# EAGLE design scheme (EAGLE 6.5.0)
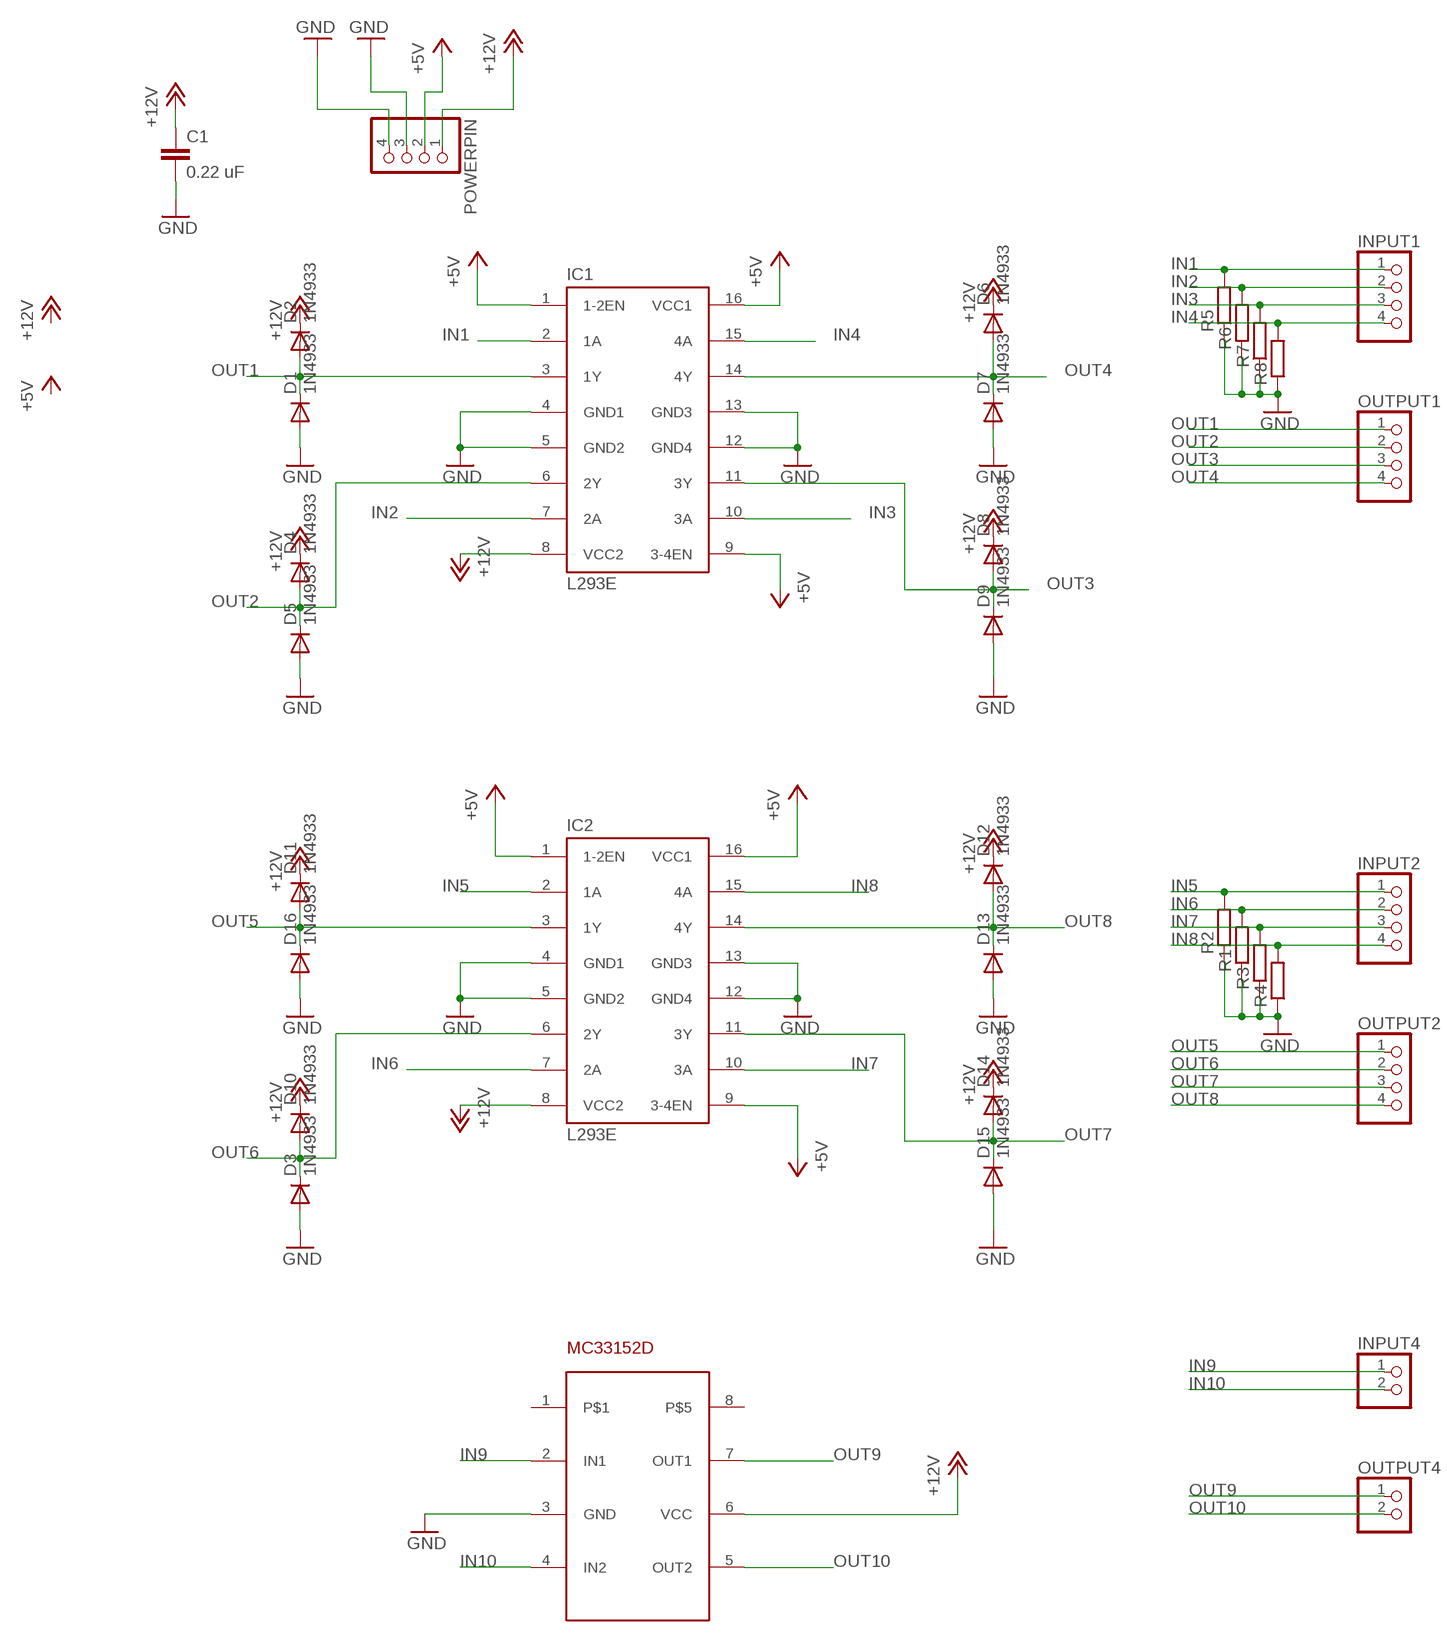
[diagram p0: schematic, sheet 1]

## Parts
C1  0.22 uF  C-EUC0805K  [C0805K]
D1  1N4933  [DO41-10]
D2  1N4933  [DO41-10]
D3  1N4933  [DO41-10]
D4  1N4933  [DO41-10]
D5  1N4933  [DO41-10]
D6  1N4933  [DO41-10]
D7  1N4933  [DO41-10]
D8  1N4933  [DO41-10]
D9  1N4933  [DO41-10]
D10  1N4933  [DO41-10]
D11  1N4933  [DO41-10]
D12  1N4933  [DO41-10]
D13  1N4933  [DO41-10]
D14  1N4933  [DO41-10]
D15  1N4933  [DO41-10]
D16  1N4933  [DO41-10]
IC1  L293E  [DIL16]
IC2  L293E  [DIL16]
INPUT1  PINHD-1X4  [1X04]
INPUT2  PINHD-1X4  [1X04]
INPUT4  PINHD-1X2  [1X02]
MC33152D  MC33152D  [SOIC8]
OUTPUT1  PINHD-1X4  [1X04]
OUTPUT2  PINHD-1X4  [1X04]
OUTPUT4  PINHD-1X2  [1X02]
POWERPIN  PINHD-1X4  [1X04]
R1  R-EU_R0805  [R0805]
R2  R-EU_R0805  [R0805]
R3  R-EU_R0805  [R0805]
R4  R-EU_R0805  [R0805]
R5  R-EU_R0805  [R0805]
R6  R-EU_R0805  [R0805]
R7  R-EU_R0805  [R0805]
R8  R-EU_R0805  [R0805]

## Nets
+5V: IC1.1(1-2EN) IC1.9(3-4EN) IC1.16(VCC1) IC2.1(1-2EN) IC2.9(3-4EN) IC2.16(VCC1) POWERPIN.2
+12V: C1.1 D2.C D4.C D6.C D8.C D10.C D11.C D12.C D14.C IC1.8(VCC2) IC2.8(VCC2) MC33152D.6(VCC) POWERPIN.1
GND: C1.2 D1.A D3.A D5.A D7.A D9.A D13.A D15.A D16.A IC1.4(GND1) IC1.5(GND2) IC1.12(GND4) IC1.13(GND3) IC2.4(GND1) IC2.5(GND2) IC2.12(GND4) IC2.13(GND3) MC33152D.3(GND) POWERPIN.3 POWERPIN.4 R1.1 R2.1 R3.1 R4.1 R5.1 R6.1 R7.1 R8.1
IN1: IC1.2(1A) INPUT1.1 R5.2
IN2: IC1.7(2A) INPUT1.2 R6.2
IN3: IC1.10(3A) INPUT1.3 R7.2
IN4: IC1.15(4A) INPUT1.4 R8.2
IN5: IC2.2(1A) INPUT2.1 R2.2
IN6: IC2.7(2A) INPUT2.2 R1.2
IN7: IC2.10(3A) INPUT2.3 R3.2
IN8: IC2.15(4A) INPUT2.4 R4.2
IN9: INPUT4.1 MC33152D.2(IN1)
IN10: INPUT4.2 MC33152D.4(IN2)
OUT1: D1.C D2.A IC1.3(1Y) OUTPUT1.1
OUT2: D4.A D5.C IC1.6(2Y) OUTPUT1.2
OUT3: D8.A D9.C IC1.11(3Y) OUTPUT1.3
OUT4: D6.A D7.C IC1.14(4Y) OUTPUT1.4
OUT5: D11.A D16.C IC2.3(1Y) OUTPUT2.1
OUT6: D3.C D10.A IC2.6(2Y) OUTPUT2.2
OUT7: D14.A D15.C IC2.11(3Y) OUTPUT2.3
OUT8: D12.A D13.C IC2.14(4Y) OUTPUT2.4
OUT9: MC33152D.7(OUT1) OUTPUT4.1
OUT10: MC33152D.5(OUT2) OUTPUT4.2
Unconnected: MC33152D.1 MC33152D.8

## Library data of the parts
C1 = resistor:C-EU: CAPACITOR, European symbol
D1-D16 = diode:1N4933: DIODE fast recovery rectifier, 1A
IC1 IC2 = texas:L293E: TI DEVICE; MF: Arrow Electronics; MPN: L293E; OC_FARNELL: 1467711; OC_NEWARK: 89K0732
INPUT1 INPUT2 OUTPUT1 OUTPUT2 POWERPIN = pinhead:PINHD-1X4: PIN HEADER
INPUT4 OUTPUT4 = pinhead:PINHD-1X2: PIN HEADER
MC33152D = mylib:MC33152D
R1-R8 = resistor:R-EU_: RESISTOR, European symbol

## Board
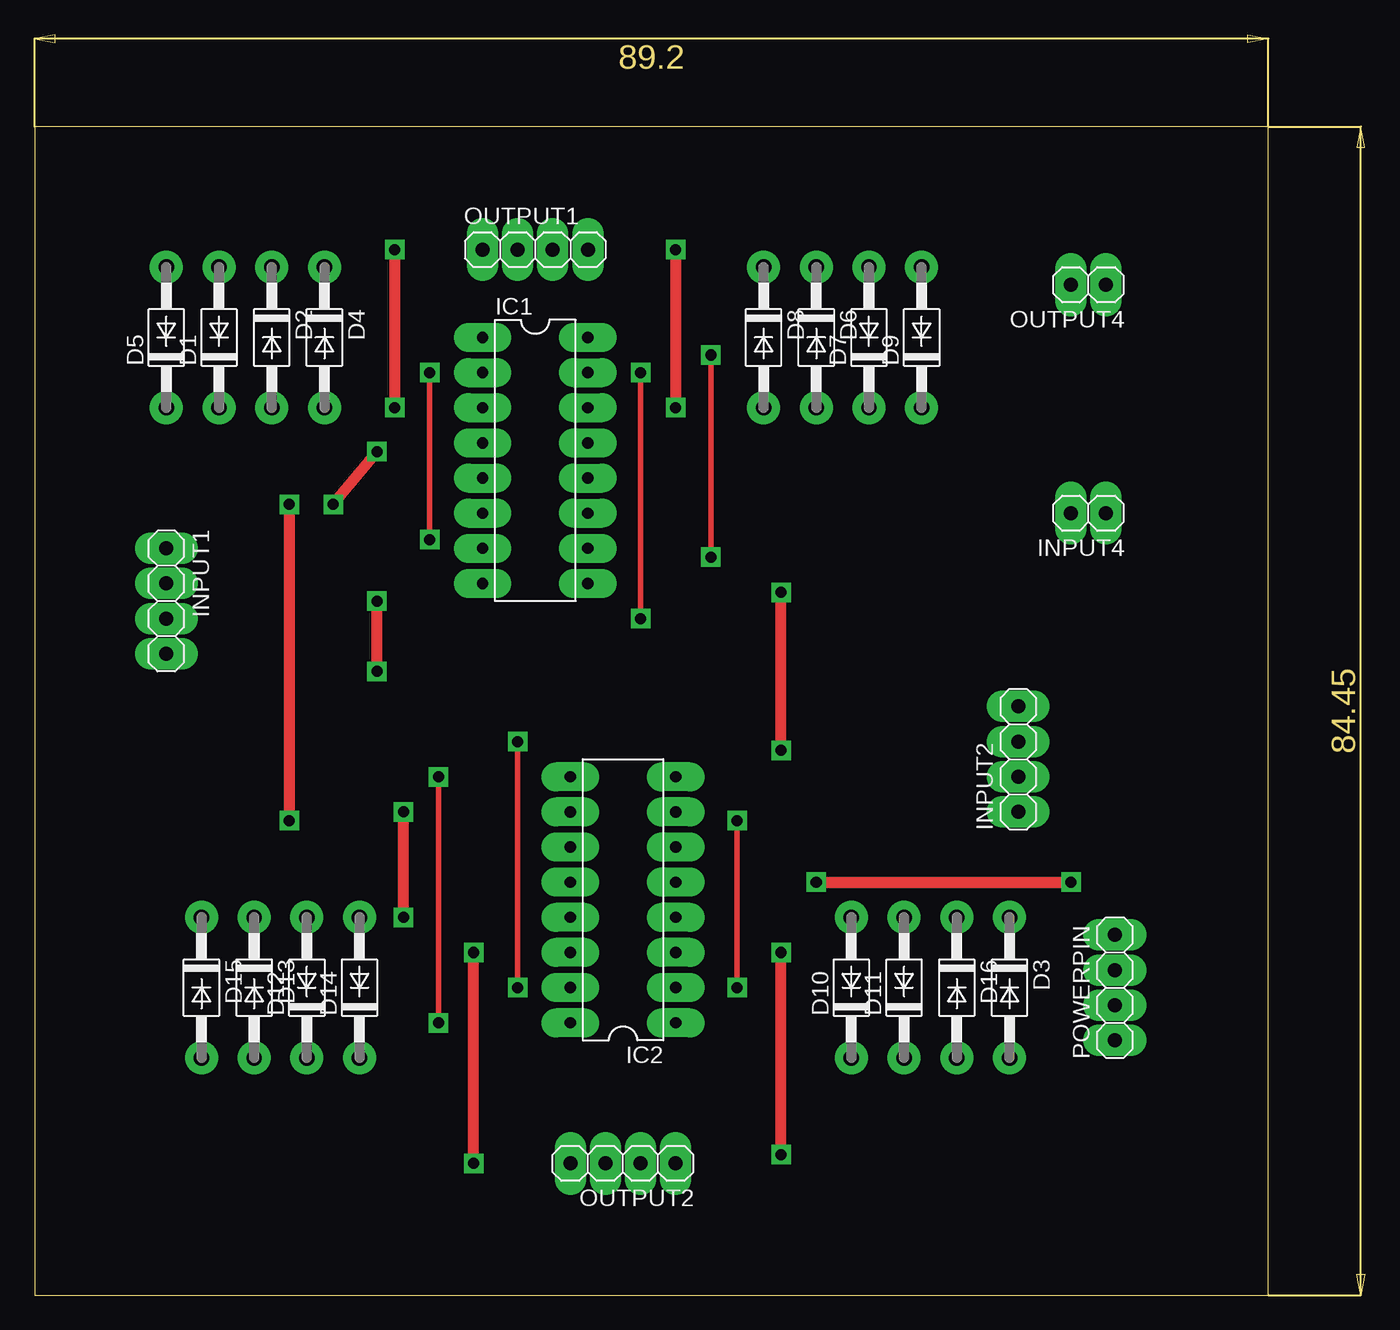
[diagram p1: board, top side]
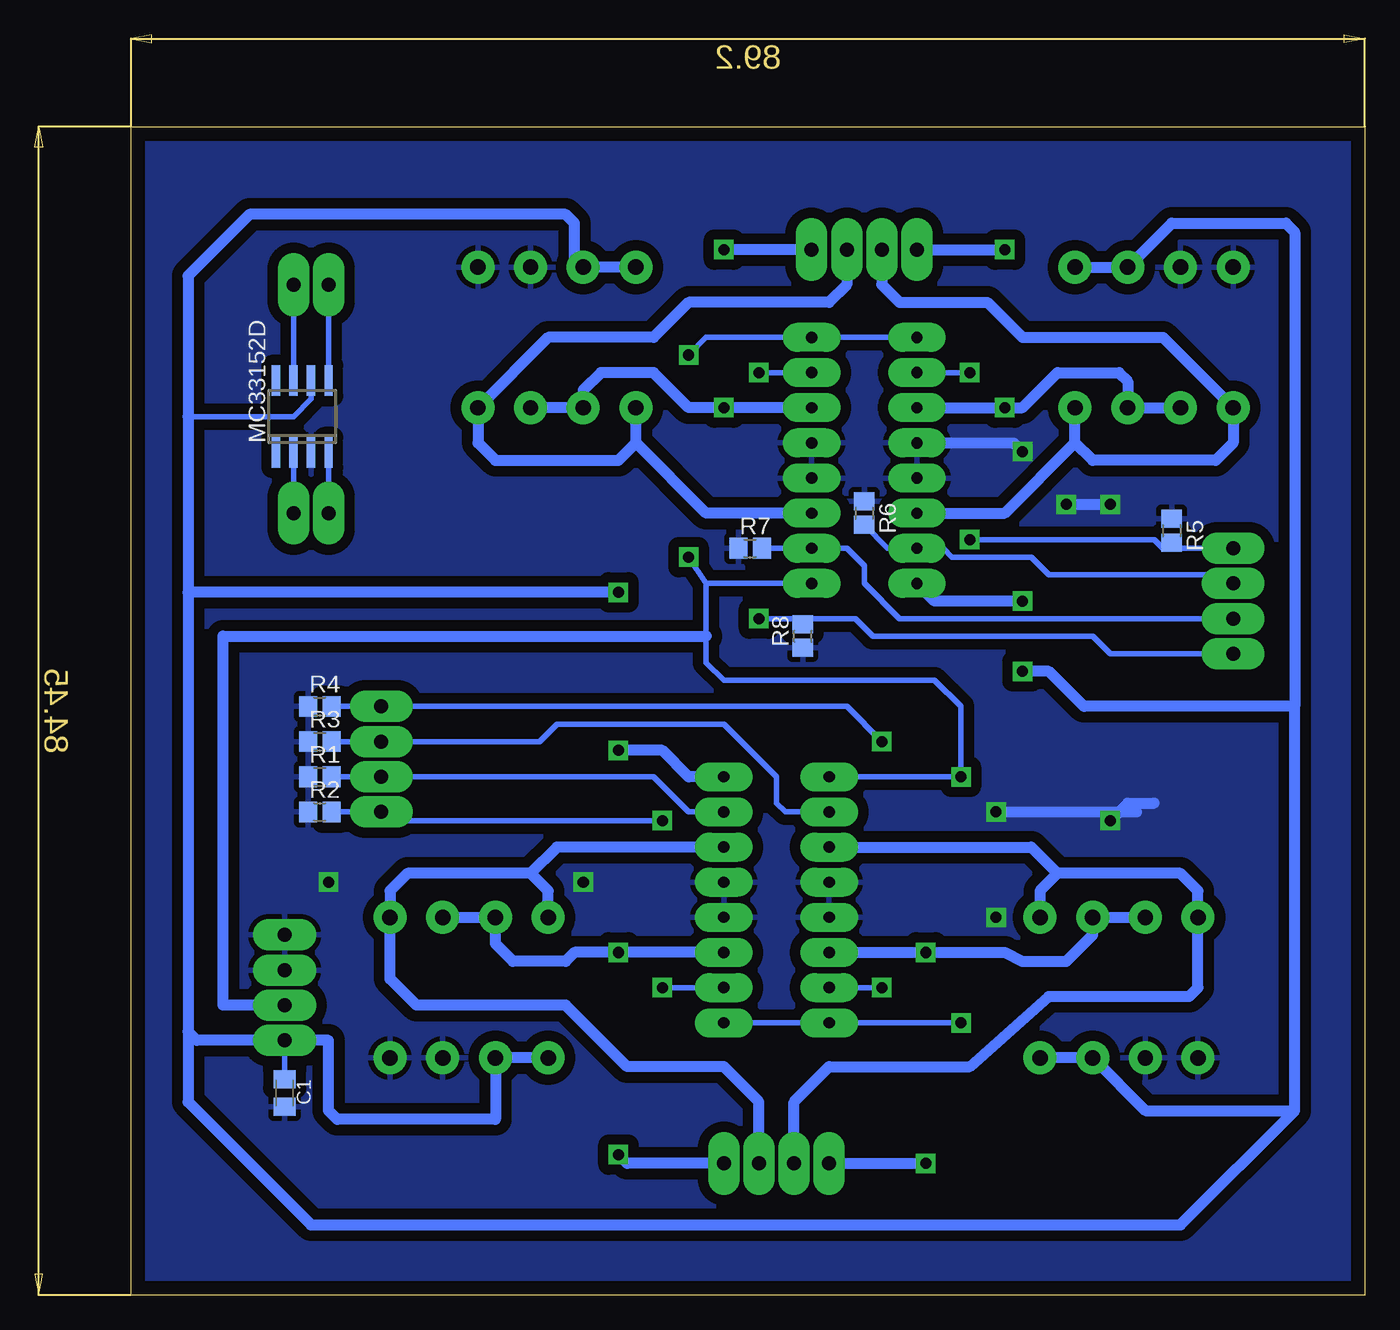
[diagram p2: board, bottom side, seen from below]

Size 89.2 x 84.45 mm. Coordinates in mm from the lower left corner, seen from the top.
Outline: 0,0 89.2,0 89.2,84.45 0,84.45 0,0
Copper layers (1*16): Top 0.035mm / dielectric 1.5mm / Bottom 0.035mm
Design rules "default": minimum track width 10mil, minimum drill 32mil, track to track 12mil, track to pad 12mil, pad to pad 12mil, via to via 12mil, smd to smd 8mil, copper to edge 40mil, drill to drill 40mil, minimum pad ring 25mil, minimum via ring 12mil, stop-mask expansion 4mil, vias tented up to drill 0mil, thermal gap 15mil

### Footprints (pad centres in the part's own frame; a part is rotated, then mirrored left to right if it is on the bottom)
C0805K = smd 1.3 x 1.6: 1 -1,0; 2 1,0
DO41-10 = drill 1.118: A 5.08,0; C -5.08,0
DIL16 = drill 0.813 long: 1 -8.89,-3.81; 2 -6.35,-3.81; 3 -3.81,-3.81; 4 -1.27,-3.81; 5 1.27,-3.81; 6 3.81,-3.81; 7 6.35,-3.81; 8 8.89,-3.81; 9 8.89,3.81; 10 6.35,3.81; 11 3.81,3.81; 12 1.27,3.81; 13 -1.27,3.81; 14 -3.81,3.81; 15 -6.35,3.81; 16 -8.89,3.81
1X04 = drill 1.016 long: 1 -3.81,0; 2 -1.27,0; 3 1.27,0; 4 3.81,0
1X02 = drill 1.016 long: 1 -1.27,0; 2 1.27,0
SOIC8 = smd 0.6 x 2.2: 1 -1.905,-2.6; 2 -0.635,-2.6; 3 0.635,-2.6; 4 1.905,-2.6; 5 1.905,2.6; 6 0.635,2.6; 7 -0.635,2.6; 8 -1.905,2.6
R0805 = smd 1.3 x 1.5: 1 -0.85,0; 2 0.85,0

### Placement (x,y rotation side)
C1  78.11,14.6 270 bottom
D1  13.33,69.22 90 top
D2  17.14,69.22 270 top
D3  70.48,22.23 270 top
D4  20.96,69.22 270 top
D5  9.53,69.22 90 top
D6  56.52,69.22 270 top
D7  60.33,69.22 90 top
D8  52.7,69.22 270 top
D9  64.13,69.22 90 top
D10  59.05,22.23 90 top
D11  62.87,22.23 90 top
D12  19.69,22.23 90 top
D13  15.88,22.23 270 top
D14  23.5,22.23 90 top
D15  12.06,22.23 270 top
D16  66.67,22.23 270 top
IC1  36.2,60.33 270 top
IC2  42.55,28.58 90 top
INPUT1  9.53,50.16 270 top
INPUT2  71.12,38.73 90 top
INPUT4  76.2,56.52 180 top
MC33152D  76.84,63.5 0 bottom
OUTPUT1  36.2,75.56 0 top
OUTPUT2  42.55,9.53 180 top
OUTPUT4  76.2,73.03 180 top
POWERPIN  78.11,22.23 90 top
R1  75.56,37.47 0 bottom
R2  75.56,34.93 0 bottom
R3  75.56,40.01 0 bottom
R4  75.56,42.55 0 bottom
R5  13.97,55.25 270 bottom
R6  36.2,56.52 270 bottom
R7  44.45,53.98 0 bottom
R8  40.64,47.62 90 bottom

### Tracks (layer width: path | path; a pad name or v marks a point on that pad's centre or on a via)
+5V  (via drill 0.8)
  Top 0.406: v48.9,67.95 v48.9,53.34 | v29.21,19.69 v29.21,37.47
  Bottom 0.406: IC1.1 IC1.16 47.62,69.22 v48.9,67.95 | v48.9,53.34 47.62,51.44 | IC2.1 IC2.16 v29.21,19.69 | IC2.9 v29.21,37.47 29.21,42.55 31.12,44.45 46.36,44.45 47.62,45.72 47.62,47.62 47.62,51.44 | IC1.9 47.62,51.44
  Bottom 0.813: POWERPIN.2 82.55,20.96 82.55,47.62 47.62,47.62
+12V  (via drill 0.8)
  Top 0.813: v24.77,45.09 v24.77,50.16 | v53.98,39.37 v53.98,50.8
  Bottom 0.406: MC33152D.6 76.2,64.77 77.47,63.5 85.09,63.5 | POWERPIN.1 C1.1
  Bottom 0.813: D8.C D6.C 57.15,74.93 57.15,77.47 57.79,78.11 80.64,78.11 85.09,73.66 85.09,63.5 85.09,50.8 | D14.C D12.C 15.88,13.33 5.08,13.33 | D10.C D11.C 62.87,12.7 74.3,12.7 74.93,13.33 74.93,18.42 POWERPIN.1 84.45,18.42 85.09,19.05 | D4.C D2.C 13.97,77.47 5.71,77.47 5.08,76.84 5.08,42.55 | 5.08,42.55 20.32,42.55 22.86,45.09 v24.77,45.09 | v24.77,50.16 31.12,50.16 IC1.8 | 5.08,13.33 5.08,42.55 | 85.09,50.8 85.09,19.05 | IC2.8 48.9,37.47 50.8,39.37 v53.98,39.37 | v53.98,50.8 85.09,50.8 | 5.08,13.33 13.33,5.08 76.2,5.08 85.09,13.97 85.09,19.05
GND  (via drill 0.8)
  Top 0.813: v24.77,60.96 v21.59,57.15 | v56.52,29.85 v74.93,29.85 | v26.67,27.3 v26.67,34.93 | v18.42,57.15 v18.42,34.29
  Bottom 0.813: IC1.4 25.4,61.59 v24.77,60.96 | v21.59,57.15 v18.42,57.15 | IC2.4 46.99,27.94 | v26.67,34.93 16.51,34.93 | v18.42,34.29 17.14,35.56 15.24,35.56
  pour Bottom (isolate 0.762): -0.64,87 107.31,87 107.31,-3.17 -0.64,-3.17
IN1  (via drill 0.8)
  Top 0.406: v28.58,54.61 v28.58,66.67
  Bottom 0.406: v28.58,66.67 IC1.2 | v28.58,54.61 15.24,54.61 14.6,53.98 13.97,53.98 | 13.97,53.98 INPUT1.1 | 13.97,54.61 R5.2 13.97,53.98
IN2
  Bottom 0.406: INPUT1.2 10.16,52.07 22.86,52.07 24.13,53.34 29.85,53.34 30.48,53.98 IC1.7 34.51,53.98 R6.2
IN3
  Bottom 0.406: INPUT1.3 33.66,48.9 36.2,51.44 36.2,52.7 37.47,53.98 IC1.10 R7.2
IN4  (via drill 0.8)
  Top 0.406: v43.81,48.9 v43.81,66.67
  Bottom 0.406: v43.81,66.67 IC1.15 | INPUT1.4 18.42,46.36 19.69,47.62 35.56,47.62 36.83,48.9 40.64,48.9 | 40.64,48.9 v43.81,48.9 | R8.2 40.64,48.9
IN5  (via drill 0.8)
  Top 0.406: v50.8,22.23 v50.8,34.29
  Bottom 0.406: IC2.2 v50.8,22.23 | v50.8,34.29 70.48,34.29 INPUT2.1 R2.2
IN6
  Bottom 0.406: IC2.7 48.9,34.93 51.44,37.47 INPUT2.2 R1.2
IN7
  Bottom 0.406: IC2.10 41.91,34.93 42.55,35.56 42.55,37.47 46.36,41.27 58.42,41.27 59.69,40.01 INPUT2.3 R3.2
IN8  (via drill 0.8)
  Top 0.406: v34.93,40.01 v34.93,22.23
  Bottom 0.406: v34.93,40.01 37.47,42.55 INPUT2.4 R4.2 | v34.93,22.23 IC2.15
IN9
  Bottom 0.406: MC33152D.2 INPUT4.1
IN10
  Bottom 0.406: MC33152D.4 INPUT4.2
OUT1  (via drill 0.8)
  Top 0.813: v26.04,75.56 v26.04,64.13
  Bottom 0.813: D1.C D2.A 17.14,66.04 17.78,66.67 22.23,66.67 24.77,64.13 v26.04,64.13 IC1.3 | OUTPUT1.1 v26.04,75.56
OUT2
  Bottom 0.813: IC1.6 26.04,56.52 20.96,61.59 | 20.96,61.59 19.69,60.33 10.79,60.33 9.53,61.59 D5.C 14.6,69.22 24.77,69.22 27.3,71.75 33.66,71.75 34.93,73.03 OUTPUT1.2 | 20.96,61.59 D4.A
OUT3
  Bottom 0.813: IC1.11 47.62,56.52 52.7,61.59 | 52.7,61.59 53.98,60.33 62.87,60.33 64.13,61.59 D9.C 59.05,69.22 51.44,69.22 48.9,71.75 38.73,71.75 37.47,73.03 OUTPUT1.3 | 52.7,61.59 D8.A
OUT4  (via drill 0.8)
  Top 0.813: v46.36,75.56 v46.36,64.13
  Bottom 0.813: D7.C D6.A 56.52,65.41 55.25,66.67 51.44,66.67 48.9,64.13 v46.36,64.13 IC1.14 | OUTPUT1.4 v46.36,75.56
OUT5  (via drill 0.8)
  Top 0.813: v53.98,10.16 v53.98,24.77
  Bottom 0.813: D16.C D11.A 62.87,25.4 61.59,24.13 57.79,24.13 57.15,24.77 v53.98,24.77 IC2.3 | OUTPUT2.1 53.34,9.53 v53.98,10.16
OUT6
  Bottom 0.813: D10.A 59.05,29.21 60.33,30.48 | 60.33,30.48 69.22,30.48 70.48,29.21 D3.C 70.48,22.86 68.58,20.96 57.79,20.96 53.34,16.51 46.36,16.51 43.81,13.97 OUTPUT2.2 | IC2.6 58.42,32.38 60.33,30.48
OUT7
  Bottom 0.813: 22.23,30.48 13.33,30.48 12.06,29.21 D15.C 12.06,22.23 12.7,21.59 22.86,21.59 28.58,16.51 38.73,16.51 41.27,13.97 OUTPUT2.3 | 22.23,30.48 23.5,29.21 D14.A | IC2.11 24.13,32.38 22.23,30.48
OUT8  (via drill 0.8)
  Top 0.813: v31.75,9.53 v31.75,24.77
  Bottom 0.813: D13.C D12.A 19.69,26.04 21.59,24.13 24.77,24.13 26.04,24.77 v31.75,24.77 IC2.14 | OUTPUT2.4 v31.75,9.53
OUT9
  Bottom 0.406: MC33152D.7 OUTPUT4.1
OUT10
  Bottom 0.406: MC33152D.5 OUTPUT4.2

### Text on the board
lables: A B C D | OUT3 | OUT1 | A B | A B | IN3 | IN1 | D C B A | IN2 | A B C D | +12 +5 G G | POWER | D C B A | OUT2